# EAGLE schematic Environment2 (EAGLE 7.5.0)
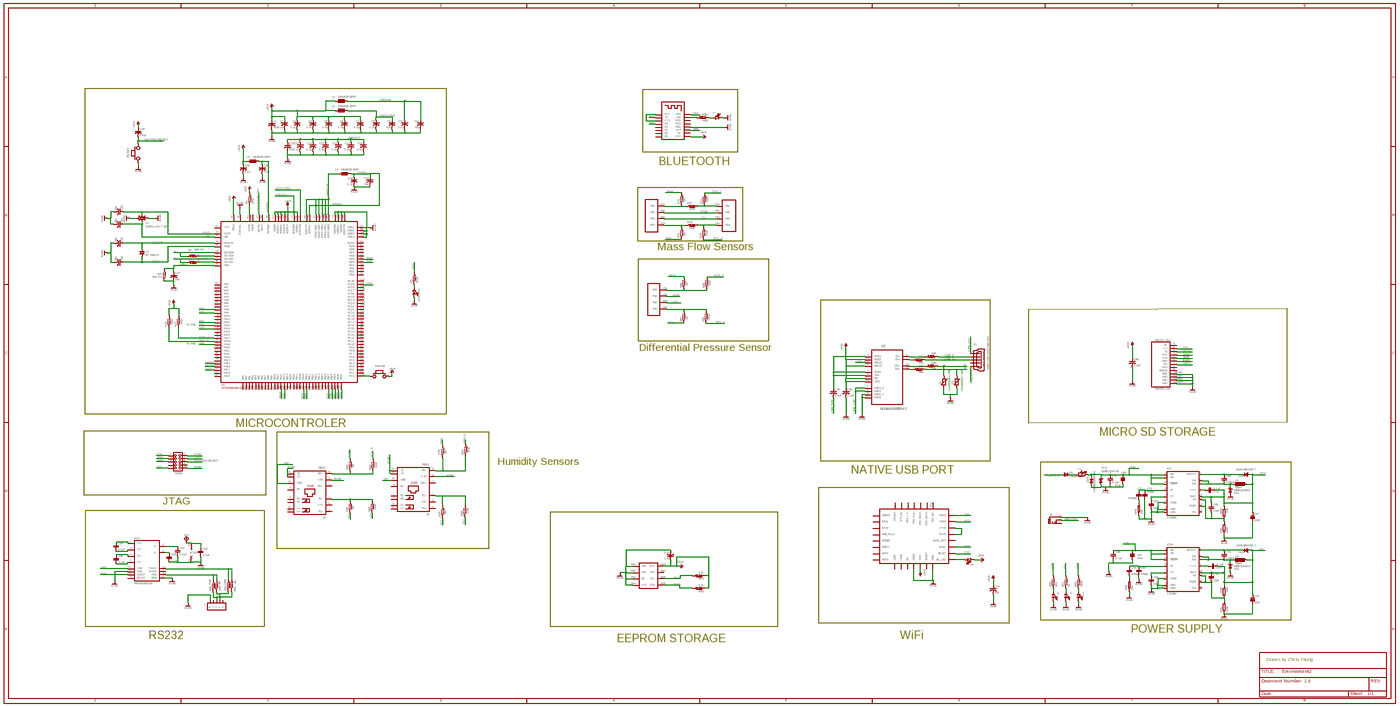
[diagram p0: schematic, sheet 1, overview]
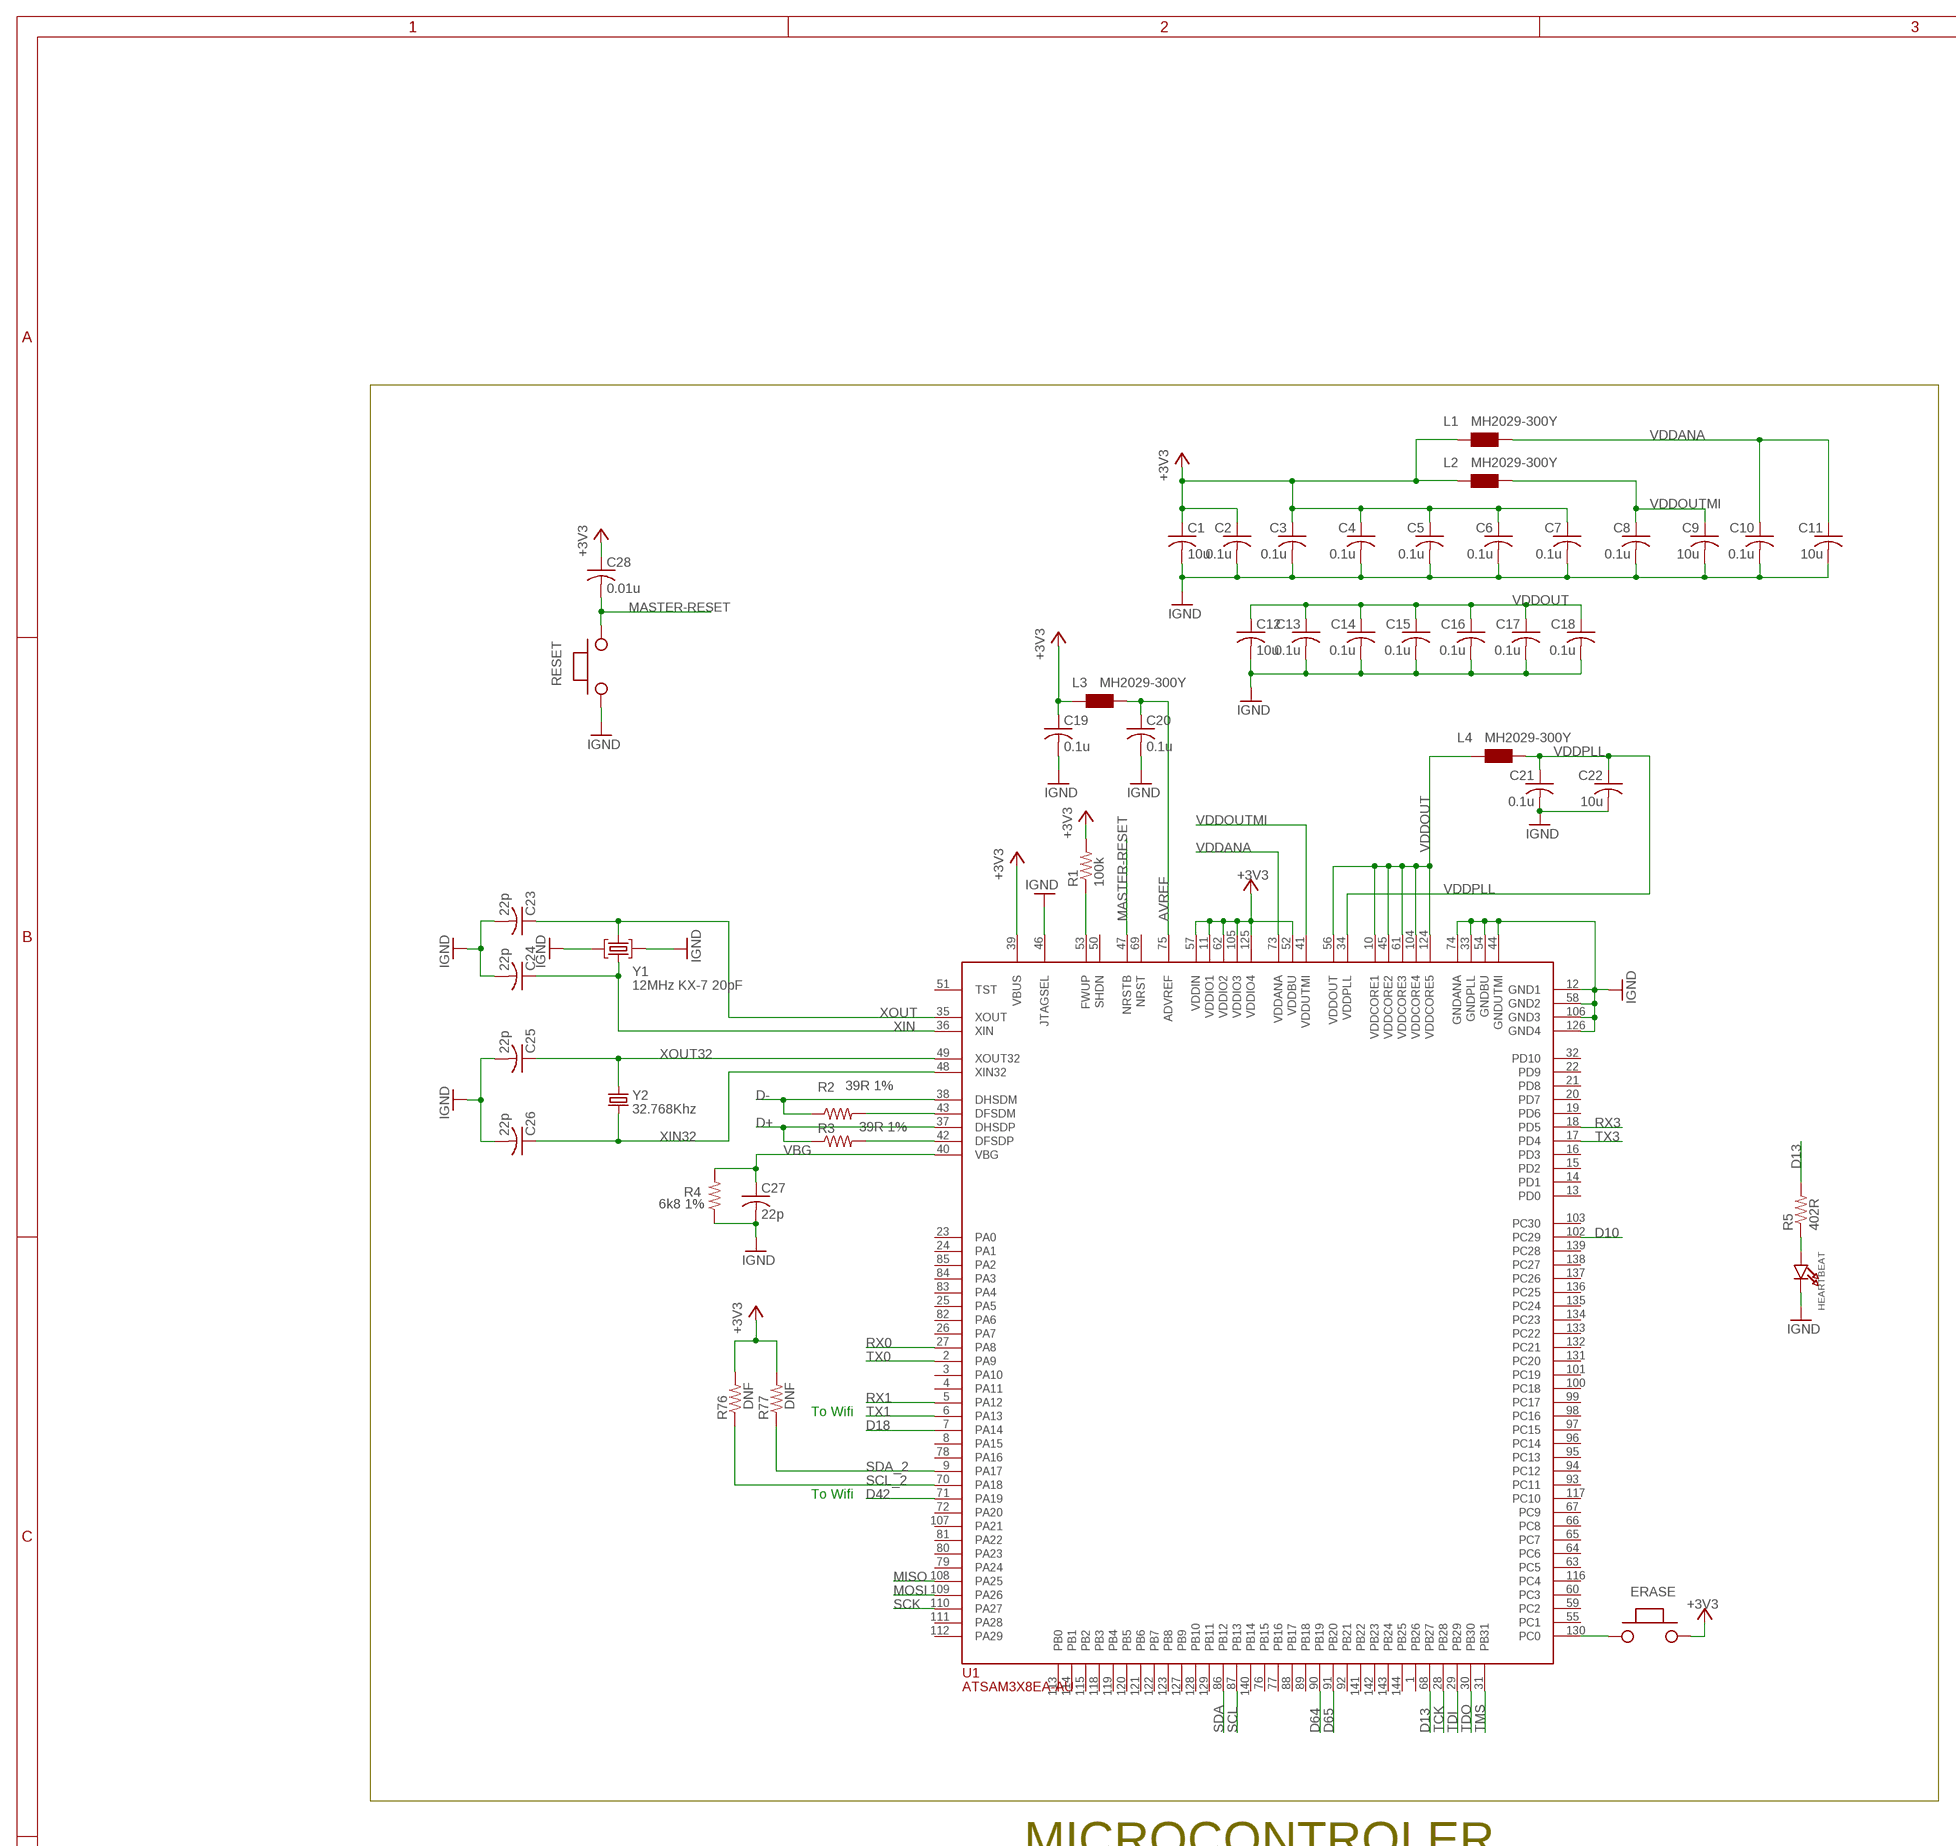
[diagram p1: schematic, sheet 1, part 1 of 7]
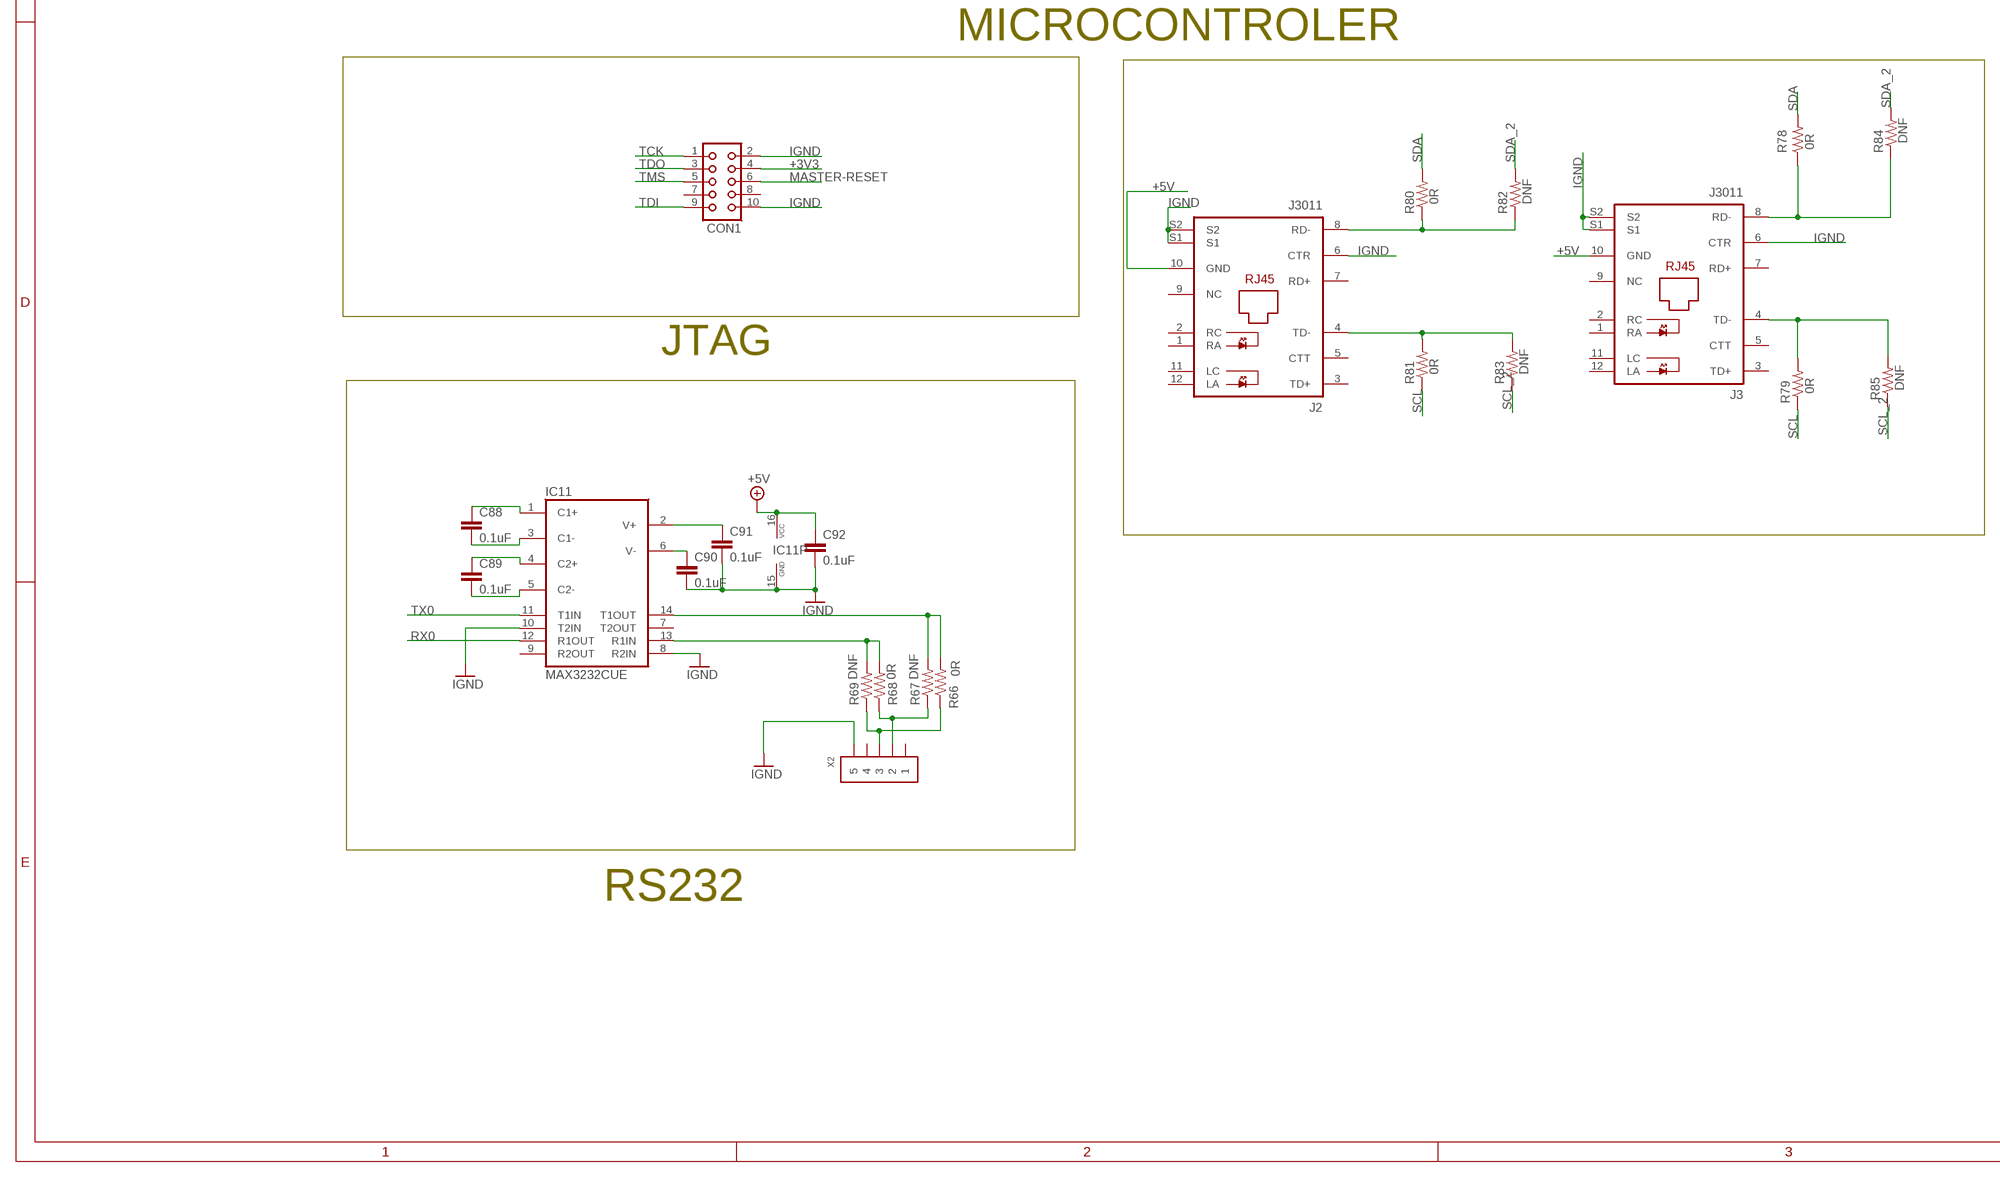
[diagram p2: schematic, sheet 1, part 2 of 7]
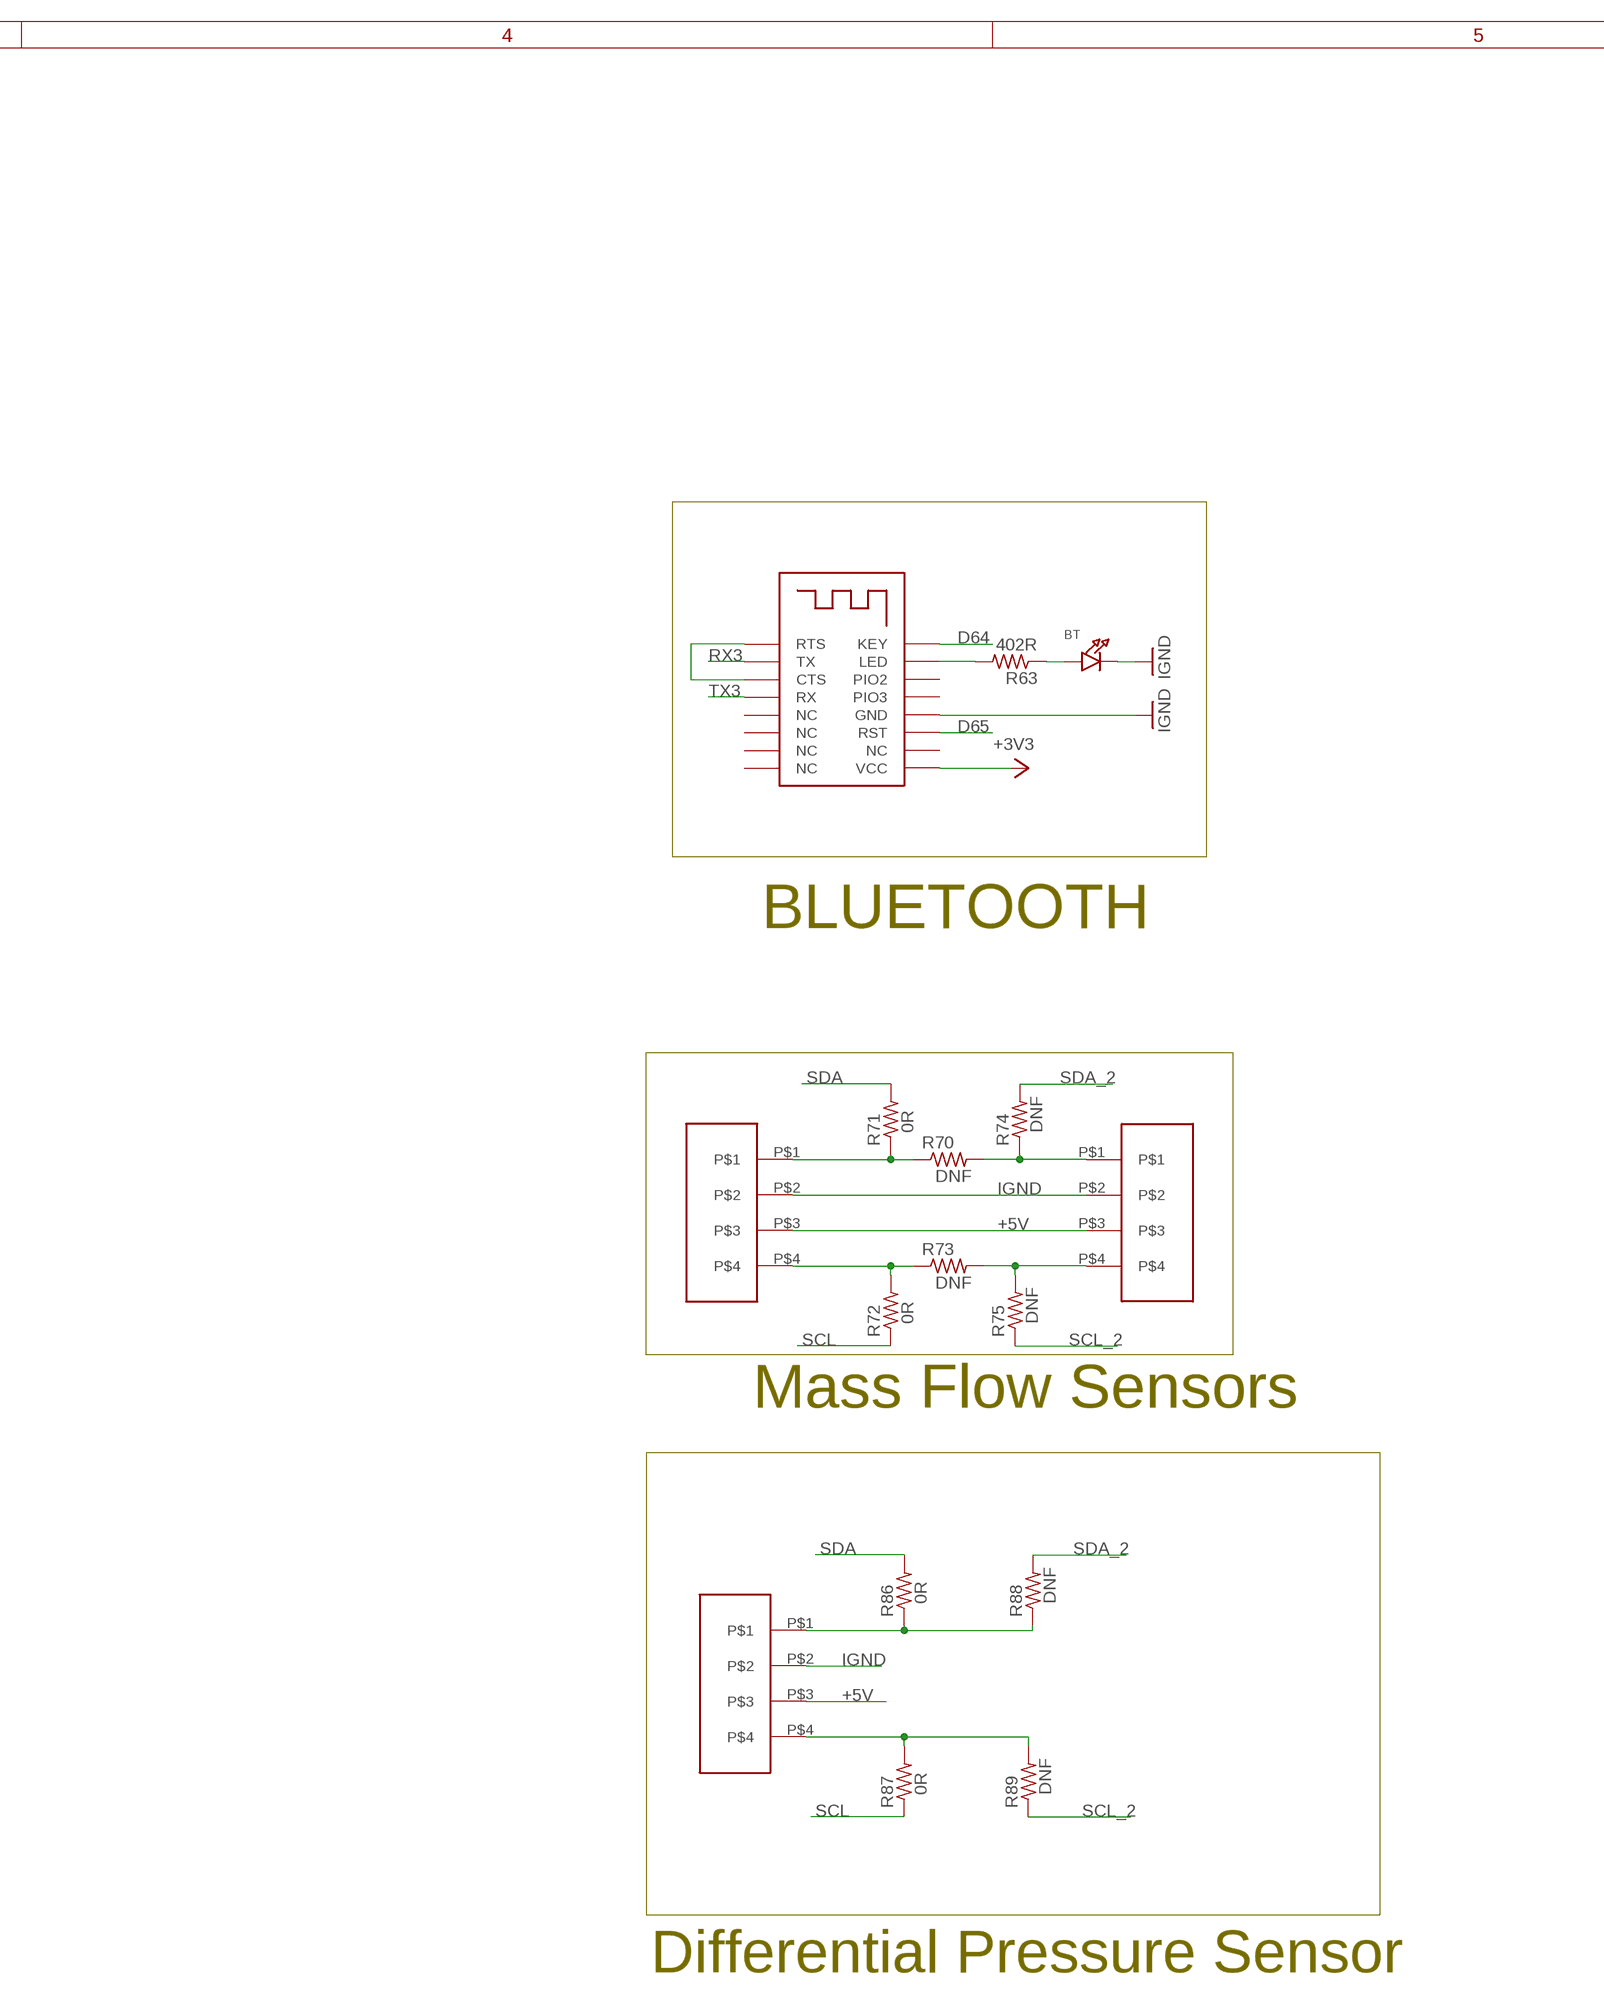
[diagram p3: schematic, sheet 1, part 3 of 7]
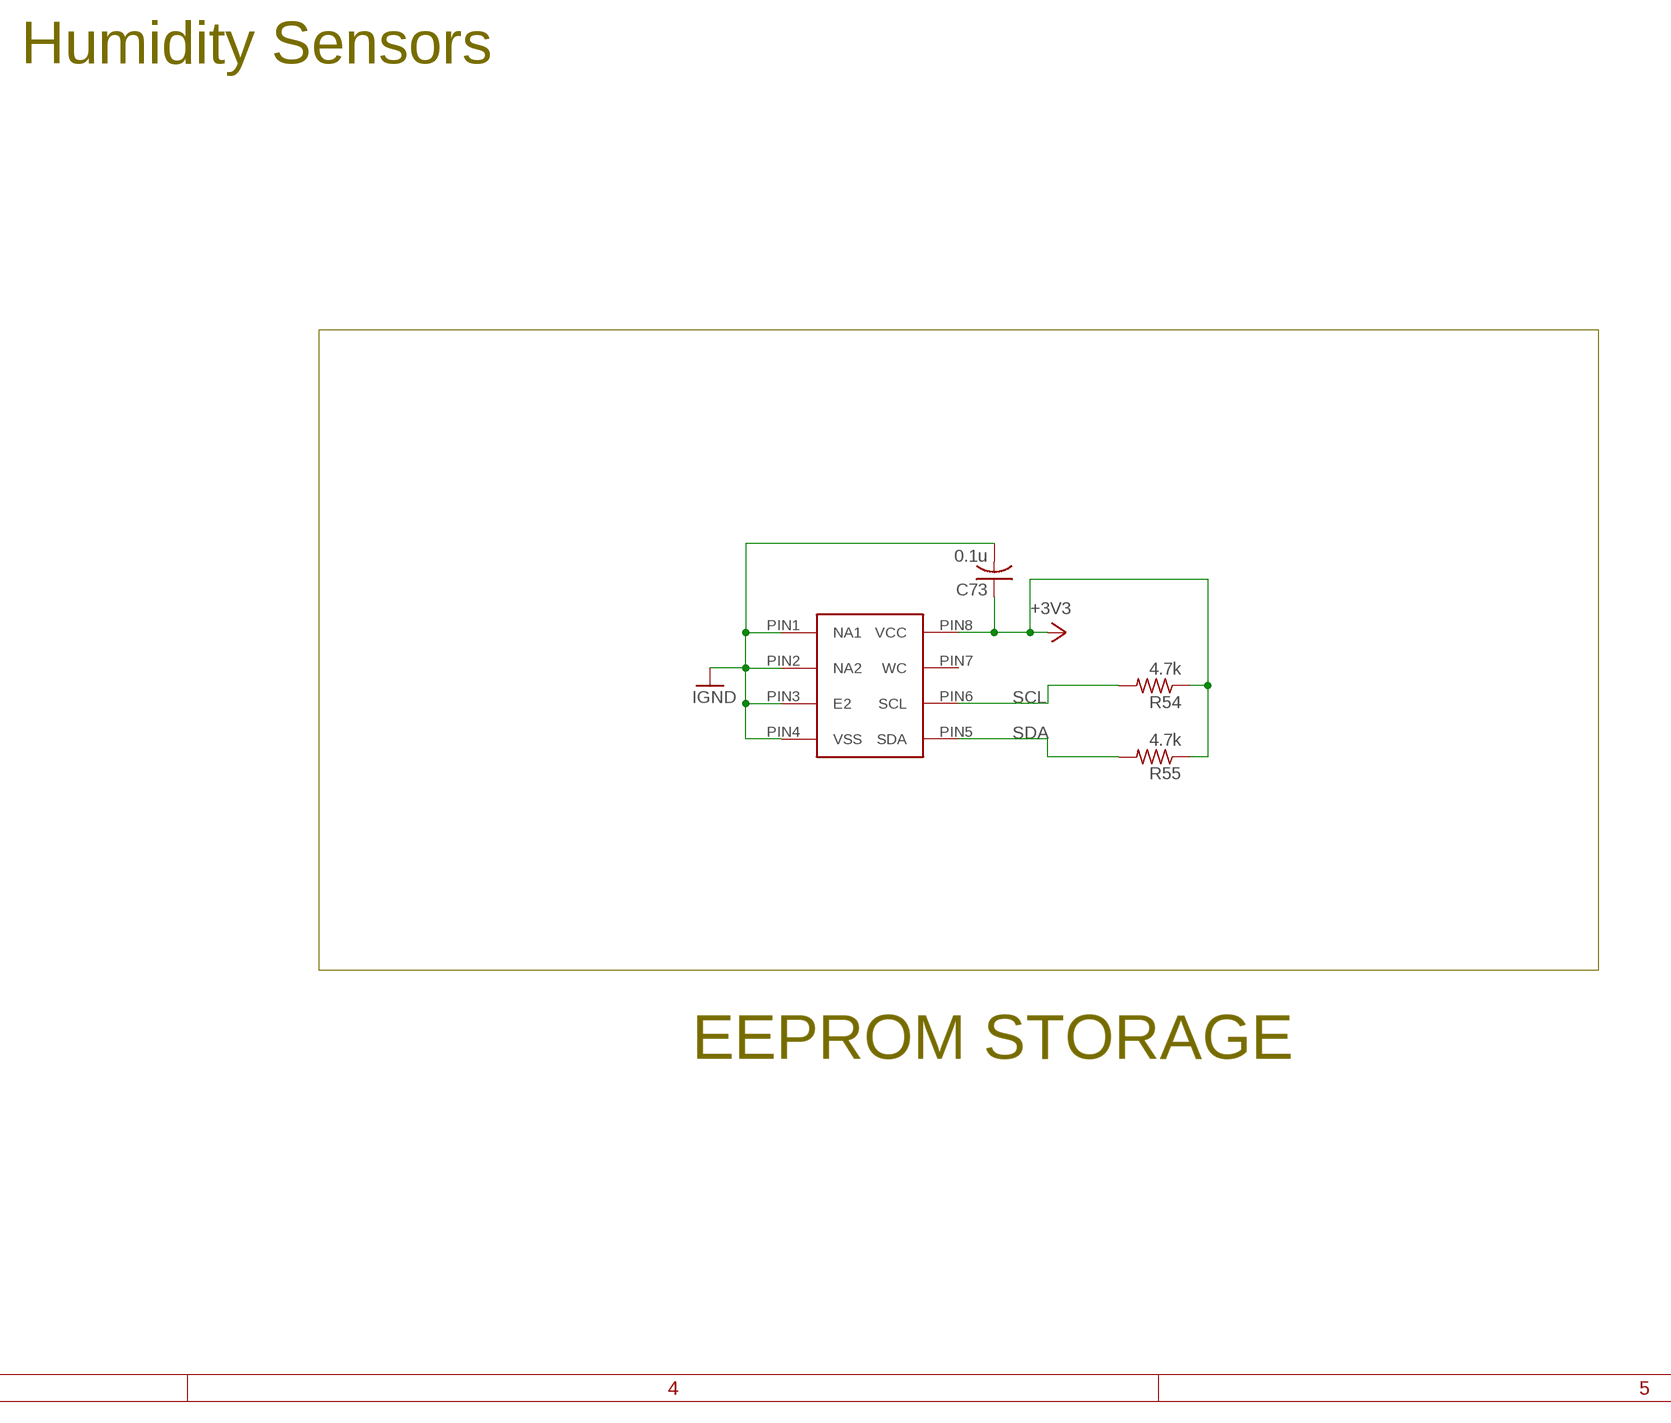
[diagram p4: schematic, sheet 1, part 4 of 7]
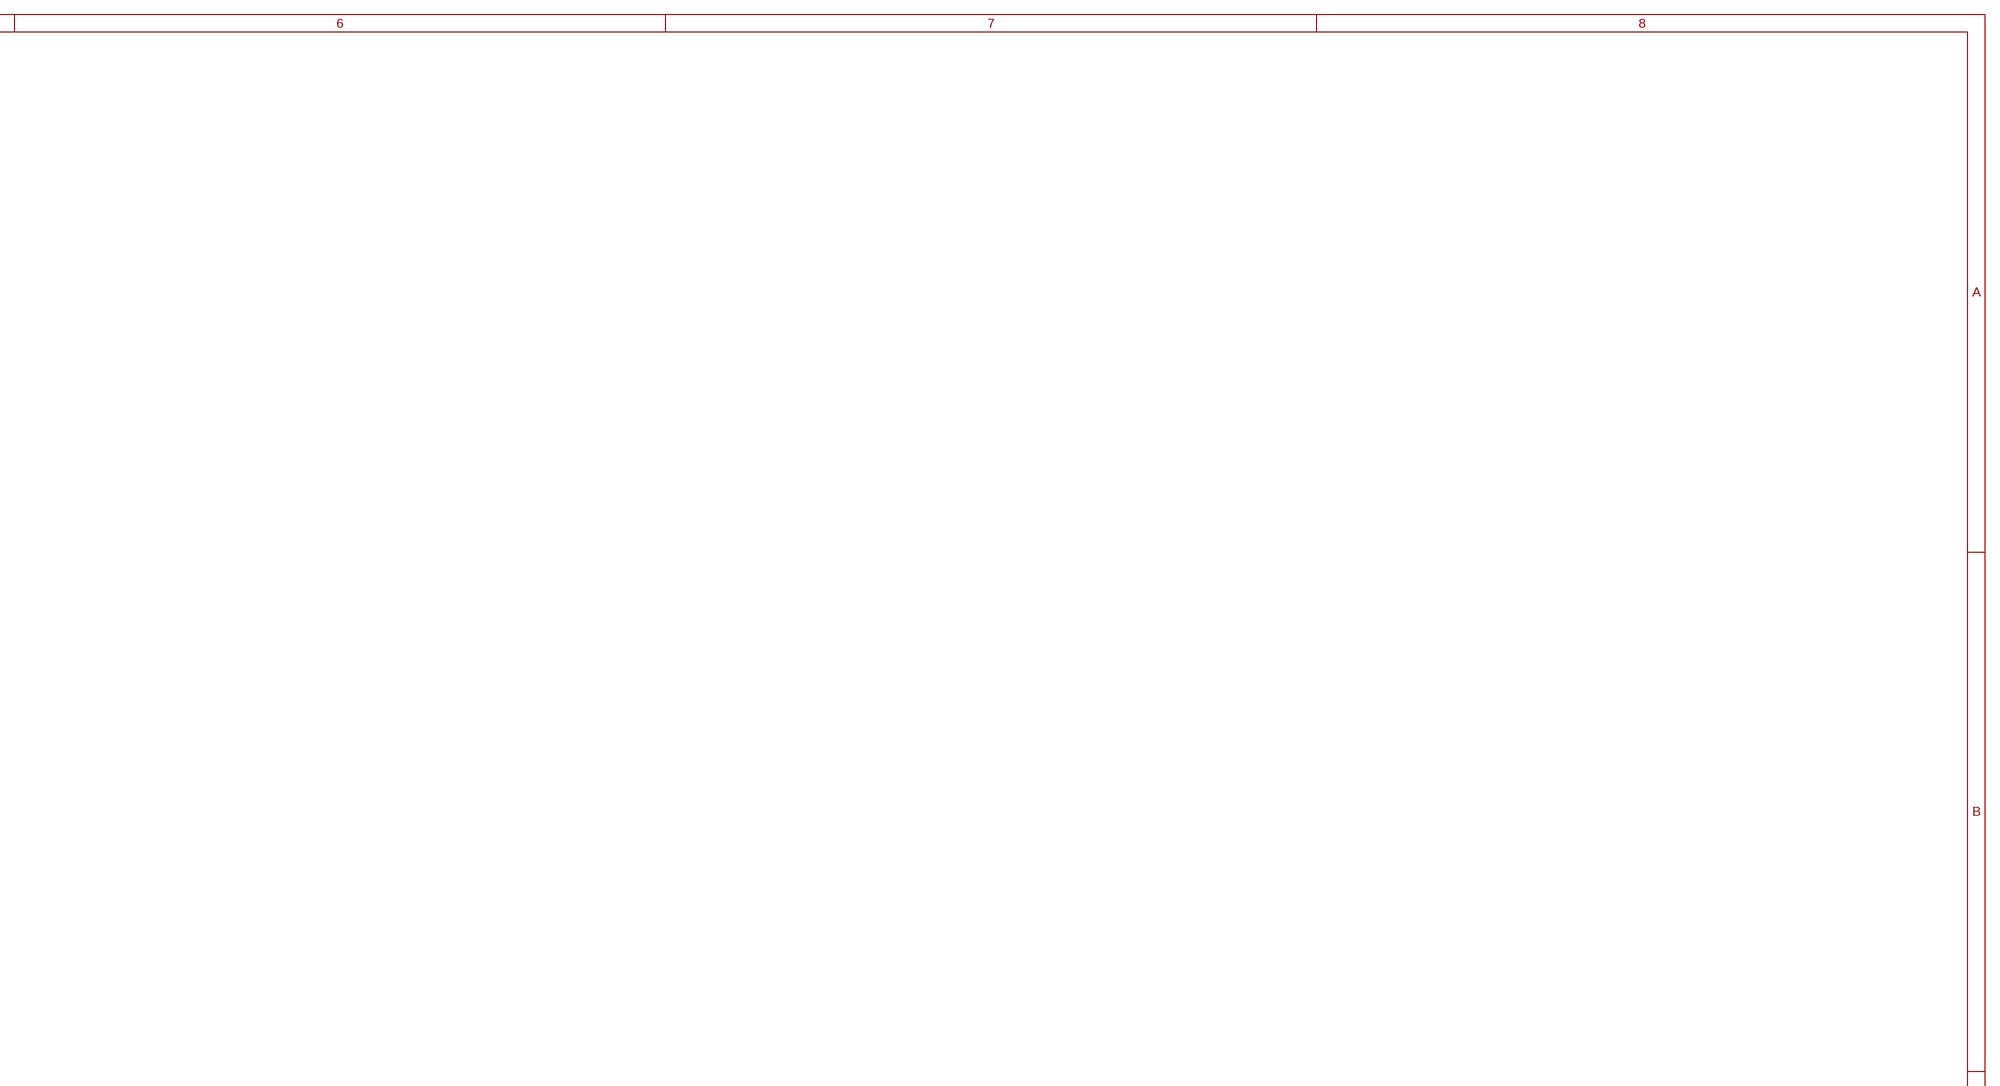
[diagram p5: schematic, sheet 1, part 5 of 7]
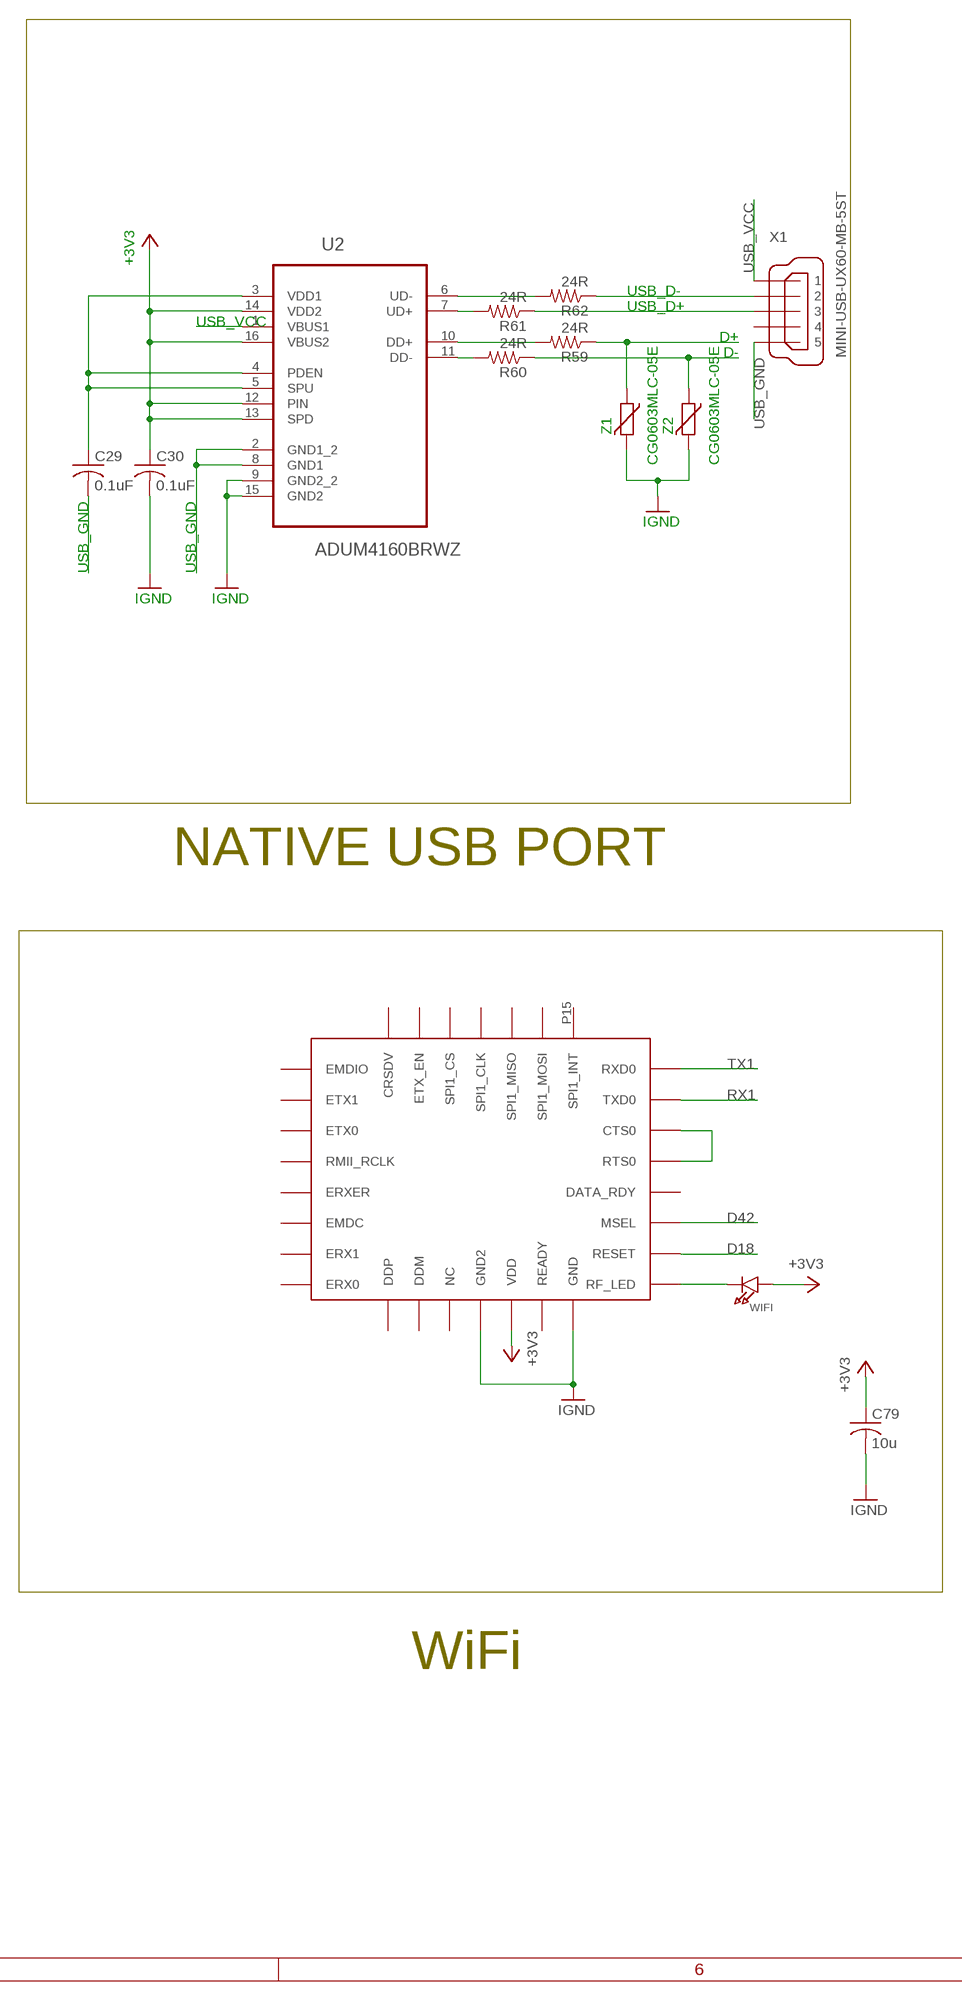
[diagram p6: schematic, sheet 1, part 6 of 7]
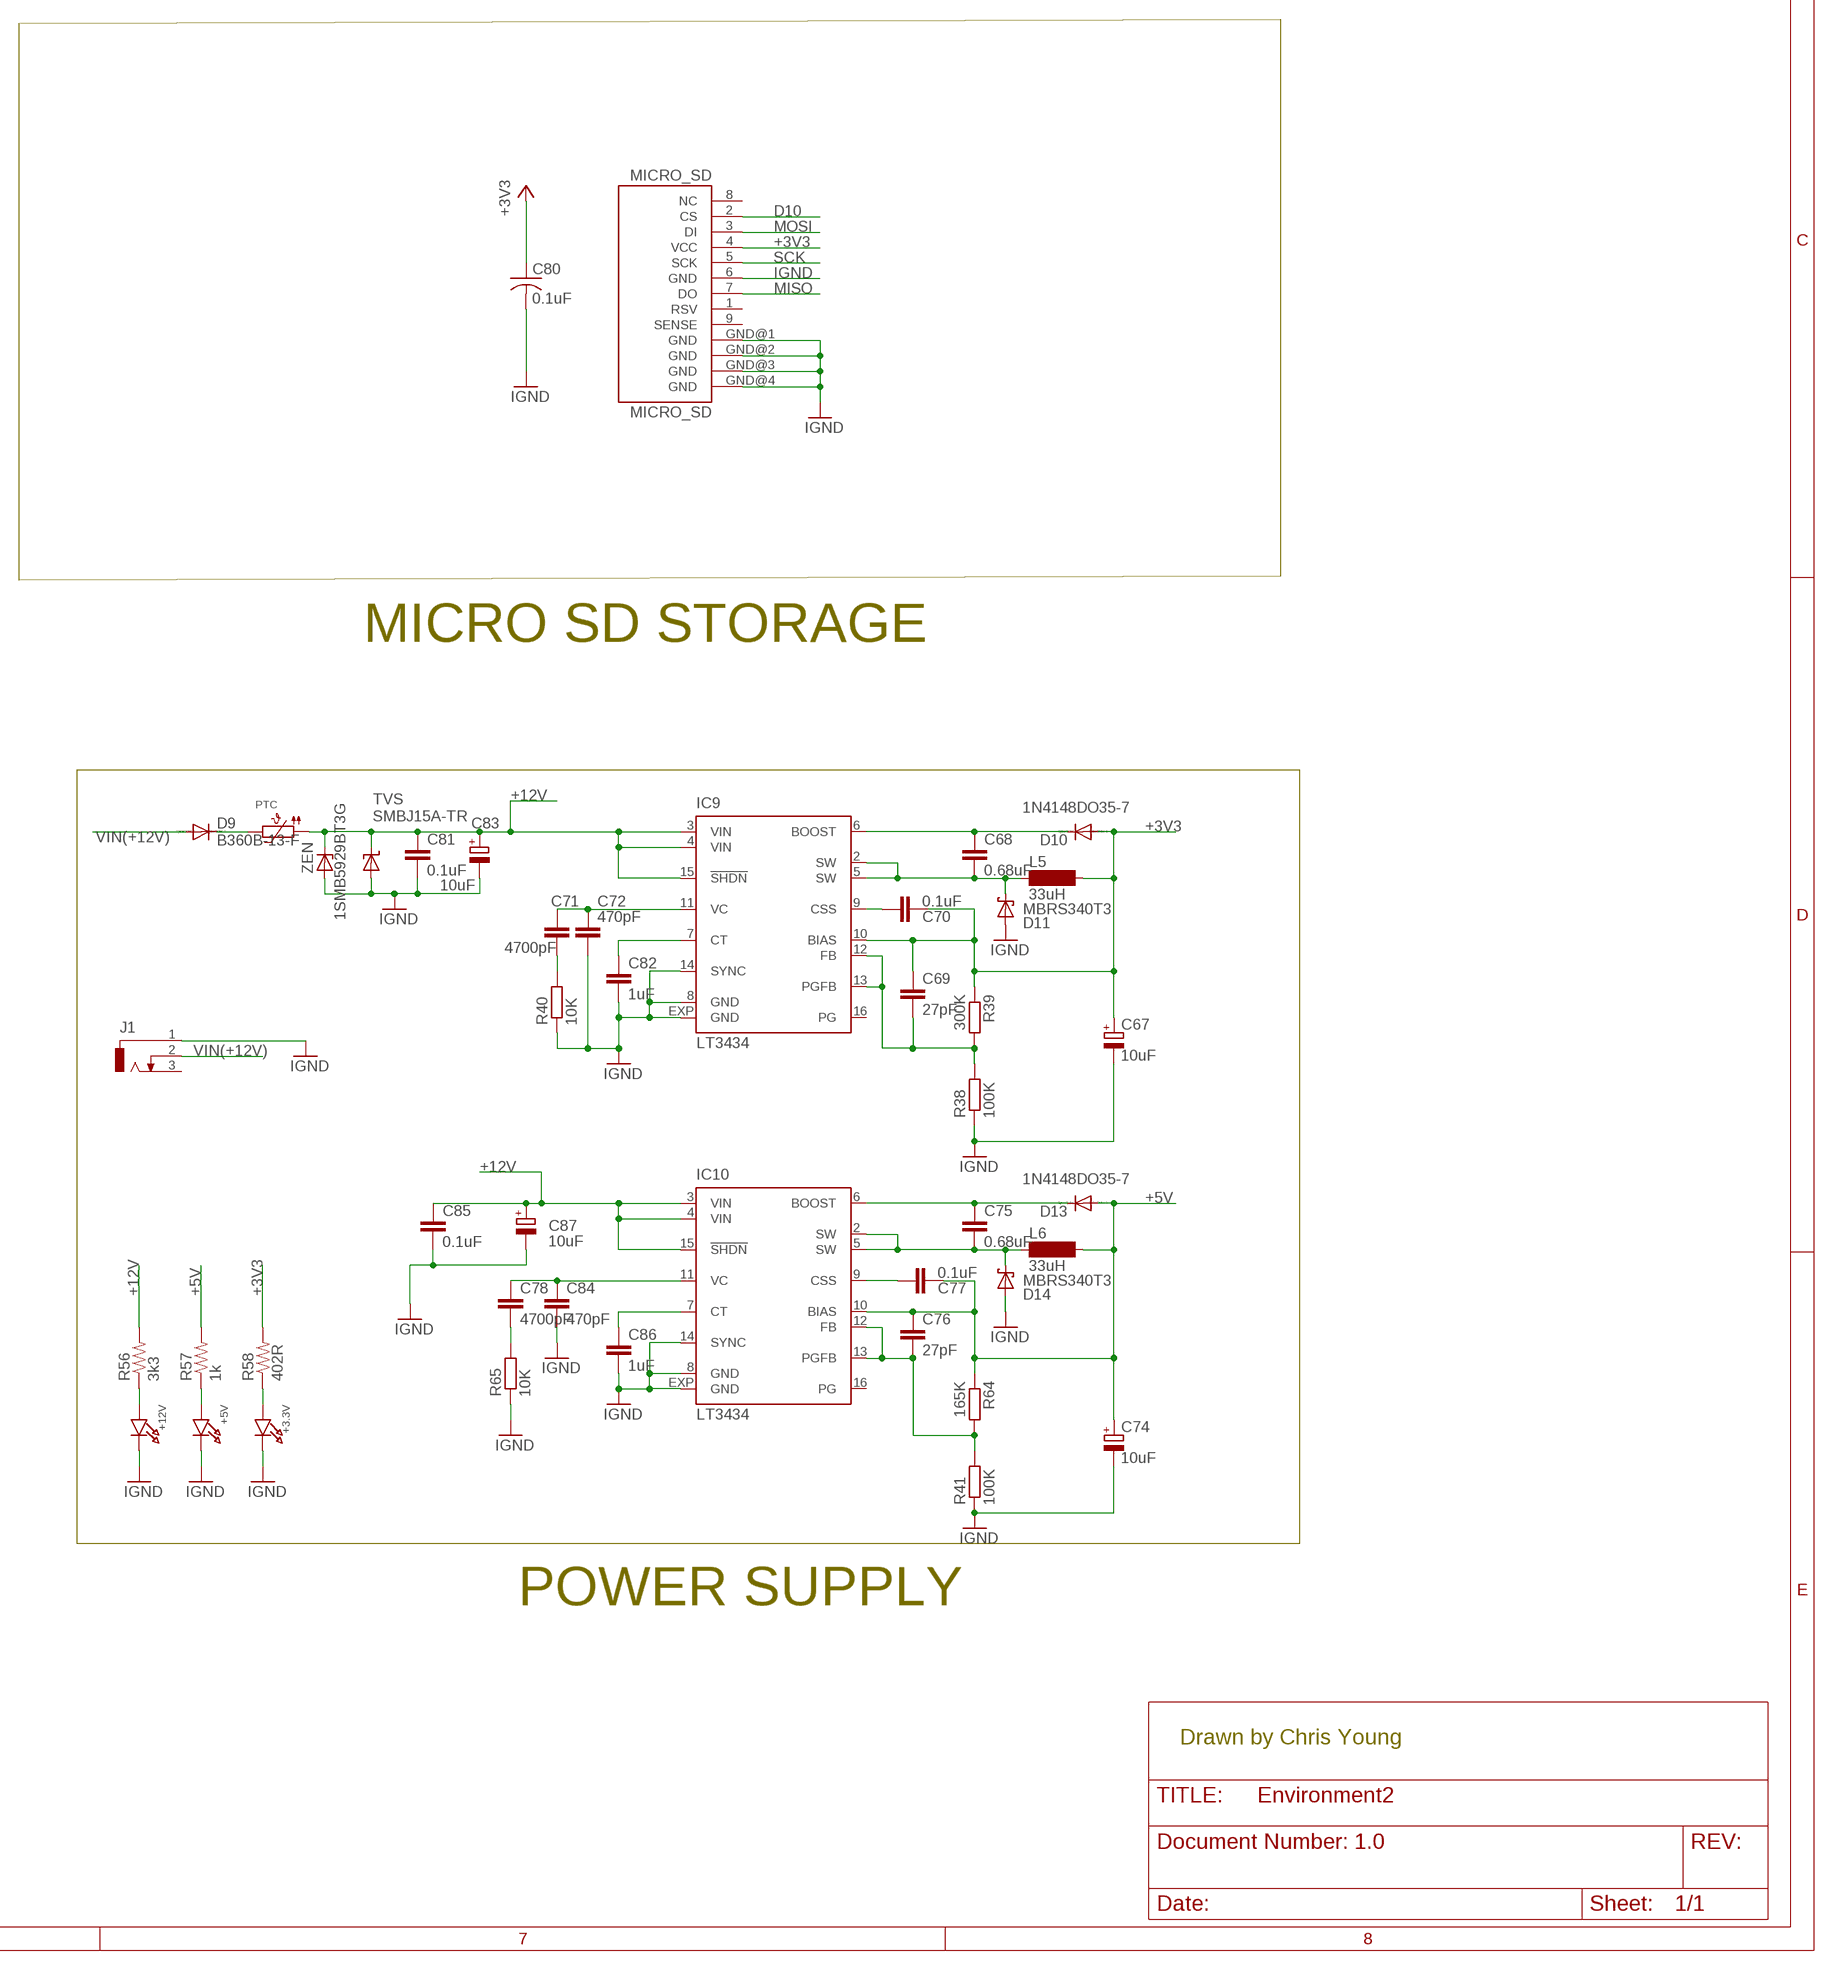
[diagram p7: schematic, sheet 1, part 7 of 7]

## Parts
+3.3V  LED0805  [CHIPLED_0805]
+5V  LED0805  [CHIPLED_0805]
+12V  LED0805  [CHIPLED_0805]
BT  LED0805  [CHIPLED_0805]
C1  10u  C-USC0805  [C0805]
C2  0.1u  C-USC0805  [C0805]
C3  0.1u  C-USC0805  [C0805]
C4  0.1u  C-USC0805  [C0805]
C5  0.1u  C-USC0805  [C0805]
C6  0.1u  C-USC0805  [C0805]
C7  0.1u  C-USC0805  [C0805]
C8  0.1u  C-USC0805  [C0805]
C9  10u  C-USC0805  [C0805]
C10  0.1u  C-USC0805  [C0805]
C11  10u  C-USC0805  [C0805]
C12  10u  C-USC0805  [C0805]
C13  0.1u  C-USC0805  [C0805]
C14  0.1u  C-USC0805  [C0805]
C15  0.1u  C-USC0805  [C0805]
C16  0.1u  C-USC0805  [C0805]
C17  0.1u  C-USC0805  [C0805]
C18  0.1u  C-USC0805  [C0805]
C19  0.1u  C-USC0805  [C0805]
C20  0.1u  C-USC0805  [C0805]
C21  0.1u  C-USC0805  [C0805]
C22  10u  C-USC0805  [C0805]
C23  22p  C-USC1206  [C1206]
C24  22p  C-USC1206  [C1206]
C25  22p  C-USC0805  [C0805]
C26  22p  C-USC0805  [C0805]
C27  22p  C-USC0805  [C0805]
C28  0.01u  C-USC0805  [C0805]
C29  0.1uF  C-USC0805  [C0805]
C30  0.1uF  C-USC0805  [C0805]
C67  10uF  CPOL-EUSMCD  [SMC_D]
C68  0.68uF  C-EUC0603  [C0603]
C69  27pF  C-EUC0603  [C0603]
C70  0.1uF  C-EUC0603  [C0603]
C71  4700pF  C-EUC0603  [C0603]
C72  470pF  C-EUC0603  [C0603]
C73  0.1u  C-USC0805  [C0805]
C74  10uF  CPOL-EUSMCD  [SMC_D]
C75  0.68uF  C-EUC0603  [C0603]
C76  27pF  C-EUC0603  [C0603]
C77  0.1uF  C-EUC0603  [C0603]
C78  4700pF  C-EUC0603  [C0603]
C79  10u  C-USC0805  [C0805]
C80  0.1uF  C-USC0805  [C0805]
C81  0.1uF  C-EUC0603  [C0603]
C82  1uF  C-EUC0603  [C0603]
C83  10uF  CPOL-EUSMCD  [SMC_D]
C84  470pF  C-EUC0603  [C0603]
C85  0.1uF  C-EUC0603  [C0603]
C86  1uF  C-EUC0603  [C0603]
C87  10uF  CPOL-EUSMCD  [SMC_D]
C88  0.1uF  C-EUC0603  [C0603]
C89  0.1uF  C-EUC0603  [C0603]
C90  0.1uF  C-EUC0603  [C0603]
C91  0.1uF  C-EUC0603  [C0603]
C92  0.1uF  C-EUC0603  [C0603]
CON1  CON10  [CON10]
D9  B360B-13-F  DIODE-SMB  [SMB]
D10  1N4148DO35-7  [DO35-7]
D11  MBRS340T3  [SMC]
D13  1N4148DO35-7  [DO35-7]
D14  MBRS340T3  [SMC]
ERASE  PUCHBUTTON  [PUCHBUTTON]
HEARTBEAT  LED0805  [CHIPLED_0805]
IC9  LT3434  [TSSOP16EXP]
IC10  LT3434  [TSSOP16EXP]
IC11  MAX3232CUE  [TSSOP16]
J1  DCJ0303  [DCJ0303]
J2  J3011  [J30]
J3  J3011  [J30]
L1  MH2029-300Y  WE-CBF_0805  [0805]
L2  MH2029-300Y  WE-CBF_0805  [0805]
L3  MH2029-300Y  WE-CBF_0805  [0805]
L4  MH2029-300Y  WE-CBF_0805  [0805]
L5  33uH  MS85  [MS85]
L6  33uH  MS85  [MS85]
MICRO_SD  MICRO_SD  MICROSD_PP  [MICROSD_PP]
PTC  PTC1812  [PTC1812]
R1  100k  R-US_R0805  [R0805]
R2  39R 1%  R-US_R0805  [R0805]
R3  39R 1%  R-US_R0805  [R0805]
R4  6k8 1%  R-US_R0805  [R0805]
R5  402R  R-US_R0805  [R0805]
R38  100K  R-EU_R0603  [R0603]
R39  300K  R-EU_R0603  [R0603]
R40  10K  R-EU_R0603  [R0603]
R41  100K  R-EU_R0603  [R0603]
R54  4.7k  R-US_R0805  [R0805]
R55  4.7k  R-US_R0805  [R0805]
R56  3k3  R-US_R0805  [R0805]
R57  1k  R-US_R0805  [R0805]
R58  402R  R-US_R0805  [R0805]
R59  24R  R-US_R0805  [R0805]
R60  24R  R-US_R0805  [R0805]
R61  24R  R-US_R0805  [R0805]
R62  24R  R-US_R0805  [R0805]
R63  402R  R-US_R0805  [R0805]
R64  165K  R-EU_R0603  [R0603]
R65  10K  R-EU_R0603  [R0603]
R66  0R  R-US_R0805  [R0805]
R67  DNF  R-US_R0805  [R0805]
R68  0R  R-US_R0805  [R0805]
R69  DNF  R-US_R0805  [R0805]
R70  DNF  R-US_R0805  [R0805]
R71  0R  R-US_R0805  [R0805]
R72  0R  R-US_R0805  [R0805]
R73  DNF  R-US_R0805  [R0805]
R74  DNF  R-US_R0805  [R0805]
R75  DNF  R-US_R0805  [R0805]
R76  DNF  R-US_R0805  [R0805]
R77  DNF  R-US_R0805  [R0805]
R78  0R  R-US_R0805  [R0805]
R79  0R  R-US_R0805  [R0805]
R80  0R  R-US_R0805  [R0805]
R81  0R  R-US_R0805  [R0805]
R82  DNF  R-US_R0805  [R0805]
R83  DNF  R-US_R0805  [R0805]
R84  DNF  R-US_R0805  [R0805]
R85  DNF  R-US_R0805  [R0805]
R86  0R  R-US_R0805  [R0805]
R87  0R  R-US_R0805  [R0805]
R88  DNF  R-US_R0805  [R0805]
R89  DNF  R-US_R0805  [R0805]
RESET  PUCHBUTTON  [PUCHBUTTON]
TVS  SMBJ15A-TR  SUPPRESSOR-SMBJ  [SMBJ]
U1  ATSAM3X8EA-AU  ATSAM3X/AAU  [LQFP144]
U2  ADUM4160BRWZ  [SOIC127P1032X265-16N]
U7  CK_CUSTOM_M24M02-DRMN6TP  [CK_CUSTOM_SOIC8]
U8  560020-04  [560020-4]
U9  560020-04  [560020-4]
U10  560020-04  [560020-4]
U$1  NANOREACH  [NANOREACH]
U$3  HM-13  [HM-13]
WIFI  LED0805  [CHIPLED_0805]
X1  MINI-USB-UX60-MB-5ST  [UX60-MB-5ST]
X2  CONN_5-1-502386  [CM-502386-05]
Y1  12MHz KX-7 20pF  CRYSTAL-3.2-2.5  [CRYSTAL-3.2-2.5]
Y2  32.768Khz  ARDUINO_WIFI_SHIELD_V018_TG_RESONATOR_EPSON_FC_145  [ARDUINO_WIFI_SHIELD_V018_TG_RESONATOR_EPSON_FC_145]
Z1  CG0603MLC-05E  VARISTORCN0603  [CT/CN0603]
Z2  CG0603MLC-05E  VARISTORCN0603  [CT/CN0603]
ZEN  1SMB5929BT3G  ZENER-DIODESMB  [SMB]

## Nets
+3V3: C1.1 C2.1 C3.1 C4.1 C5.1 C6.1 C7.1 C19.1 C28.1 C30.1 C67.+ C69.1 C70.2 C73.1 C79.1 C80.1 CON1.4 D10.A ERASE.P$2 IC9.10(BIAS) L1.1 L2.1 L3.1 L5.2 MICRO_SD.4(VCC) R1.2 R39.1 R54.1 R55.1 R58.2 R76.2 R77.2 U1.11(VDDIO1) U1.39(VBUS) U1.52(VDDBU) U1.57(VDDIN) U1.62(VDDIO2) U1.105(VDDIO3) U1.125(VDDIO4) U2.12(PIN) U2.13(SPD) U2.14(VDD2) U2.16(VBUS2) U7.PIN8(VCC) U$1.P1(VDD) U$3.P$9(VCC) WIFI.A
+5V: C74.+ C76.1 C77.2 C92.1 D13.A IC10.10(BIAS) IC11.16(VCC) J2.10(GND) L6.2 R57.2 R64.1 U8.P$3 U9.P$3 U10.P$3
+12V: C81.1 C83.+ C85.1 C87.+ IC9.3(VIN) IC9.4(VIN) IC9.15(!SHDN) IC10.3(VIN) IC10.4(VIN) IC10.15(!SHDN) PTC.P$1 R56.2 TVS.C ZEN.C
A: R70.2 R74.1 U9.P$1
AVREF: C20.1 L3.2 U1.75(ADVREF)
B: R73.2 R75.2 U9.P$4
D10: MICRO_SD.2(CS) U1.102(PC29)
D13: R5.2 U1.68(PB27)
D18: U1.7(PA14) U$1.P9(RESET)
D42: U1.71(PA19) U$1.P8(MSEL)
D64: U1.90(PB19) U$3.P$16(KEY)
D65: U1.91(PB20) U$3.P$11(RST)
D+ [USB]: R3.1 R59.1 U1.37(DHSDP) Z1.1
D- [USB]: R2.1 R60.1 U1.38(DHSDM) Z2.1
ERASE_S: ERASE.P$1 U1.130(PC0)
IGND: +3.3V.C +5V.C +12V.C BT.C C1.2 C2.2 C3.2 C4.2 C5.2 C6.2 C7.2 C8.2 C9.2 C10.2 C11.2 C12.2 C13.2 C14.2 C15.2 C16.2 C17.2 C18.2 C19.2 C20.2 C21.2 C22.2 C23.2 C24.2 C25.2 C26.2 C27.2 C30.2 C67.- C72.2 C73.2 C74.- C79.2 C80.2 C81.2 C82.2 C83.- C84.2 C85.2 C86.2 C87.- C90.2 C91.2 C92.2 CON1.2 CON1.10 D11.A D14.A HEARTBEAT.C IC9.8(GND) IC9.14(SYNC) IC9.EXP(GND) IC10.8(GND) IC10.14(SYNC) IC10.EXP(GND) IC11.8(R2IN) IC11.10(T2IN) IC11.15(GND) J1.1 J2.6(CTR) J2.S1 J2.S2 J3.6(CTR) J3.S1 J3.S2 MICRO_SD.6(GND) MICRO_SD.GND@1(GND) MICRO_SD.GND@2(GND) MICRO_SD.GND@3(GND) MICRO_SD.GND@4(GND) R4.1 R38.1 R40.1 R41.1 R65.1 RESET.P$1 TVS.A U1.12(GND1) U1.33(GNDPLL) U1.44(GNDUTMI) U1.46(JTAGSEL) U1.54(GNDBU) U1.58(GND2) U1.74(GNDANA) U1.106(GND3) U1.126(GND4) U2.9(GND2_2) U2.15(GND2) U7.PIN1(NA1) U7.PIN2(NA2) U7.PIN3(E2) U7.PIN4(VSS) U8.P$2 U9.P$2 U10.P$2 U$1.P2(GND) U$1.P20(GND2) U$3.P$12(GND) X2.5 Y1.2(GND) Y1.4(GND) Z1.2 Z2.2 ZEN.A
MASTER-RESET: C28.2 CON1.6 RESET.P$2 U1.47(NRSTB)
MISO: MICRO_SD.7(DO) U1.108(PA25)
MOSI: MICRO_SD.3(DI) U1.109(PA26)
N$2: +3.3V.A R58.1
N$3: D9.C PTC.P$2
N$4: +5V.A R57.1
N$5: C29.1 U2.3(VDD1) U2.4(PDEN) U2.5(SPU)
N$6: HEARTBEAT.A R5.1
N$7: U$3.P$1(RTS) U$3.P$3(CTS)
N$10: R62.2 U2.6(UD-)
N$11: R61.2 U2.7(UD+)
N$24: C71.1 C72.1 IC9.11(VC)
N$26: C70.1 IC9.9(CSS)
N$27: C68.1 D10.C IC9.6(BOOST)
N$28: C71.2 R40.2
N$29: C68.2 D11.C IC9.2(SW) IC9.5(SW) L5.1
N$30: C82.1 IC9.7(CT)
N$42: R59.2 U2.10(DD+)
N$44: +12V.A R56.1
N$45: R60.2 U2.11(DD-)
N$46: BT.A R63.1
N$47: R63.2 U$3.P$15(LED)
N$52: U$1.P5(CTS0) U$1.P6(RTS0)
N$53: R2.2 U1.43(DFSDM)
N$56: R3.2 U1.42(DFSDP)
N$59: R1.1 U1.53(FWUP)
N$62: C69.2 IC9.12(FB) IC9.13(PGFB) R38.2 R39.2
N$63: C75.1 D13.C IC10.6(BOOST)
N$64: C77.1 IC10.9(CSS)
N$69: C75.2 D14.C IC10.2(SW) IC10.5(SW) L6.1
N$70: C86.1 IC10.7(CT)
N$72: C78.1 C84.1 IC10.11(VC)
N$74: C78.2 R65.2
N$80: C88.1 IC11.1(C1+)
N$81: C88.2 IC11.3(C1-)
N$82: C89.1 IC11.4(C2+)
N$83: R66.1 R69.1 X2.3
N$84: R67.1 R68.1 X2.2
N$85: R70.1 R71.1 U10.P$1
N$87: R72.2 R73.1 U10.P$4
N$89: J2.8(RD-) R80.1 R82.1
N$91: J2.4(TD-) R81.2 R83.2
N$92: J3.8(RD-) R78.1 R84.1
N$98: J3.4(TD-) R79.2 R85.2
N$100: R86.1 R88.1 U8.P$1
N$101: R87.2 R89.2 U8.P$4
N$103: C76.2 IC10.12(FB) IC10.13(PGFB) R41.2 R64.2
N$115: C89.2 IC11.5(C2-)
N$128: C90.1 IC11.6(V-)
N$137: IC11.14(T1OUT) R66.2 R67.2
N$139: IC11.13(R1IN) R68.2 R69.2
N$147: C91.1 IC11.2(V+)
RX0: IC11.12(R1OUT) U1.27(PA8)
RX1: U1.5(PA12) U$1.P4(TXD0)
RX3: U1.18(PD5) U$3.P$2(TX)
SCK: MICRO_SD.5(SCK) U1.110(PA27)
SCL: R54.2 R72.1 R79.1 R81.1 R87.1 U1.87(PB13) U7.PIN6(SCL)
SCL_2: R75.1 R76.1 R83.1 R85.1 R89.1 U1.70(PA18)
SDA: R55.2 R71.2 R78.2 R80.2 R86.2 U1.86(PB12) U7.PIN5(SDA)
SDA_2: R74.2 R77.1 R82.2 R84.2 R88.2 U1.9(PA17)
TCK: CON1.1 U1.28(PB28)
TDI: CON1.9 U1.29(PB29)
TDO: CON1.3 U1.30(PB30)
TMS: CON1.5 U1.31(PB31)
TX0: IC11.11(T1IN) U1.2(PA9)
TX1: U1.6(PA13) U$1.P3(RXD0)
TX3: U1.17(PD4) U$3.P$4(RX)
USB_D+: R61.1 X1.3
USB_D-: R62.1 X1.2
USB_GND: C29.2 U2.2(GND1_2) U2.8(GND1) X1.5
USB_VCC: U2.1(VBUS1) X1.1
VBG: C27.1 R4.2 U1.40(VBG)
VDDANA: C10.1 C11.1 L1.2 U1.73(VDDANA)
VDDOUT: C12.1 C13.1 C14.1 C15.1 C16.1 C17.1 C18.1 L4.1 U1.10(VDDCORE1) U1.45(VDDCORE2) U1.56(VDDOUT) U1.61(VDDCORE3) U1.104(VDDCORE4) U1.124(VDDCORE5)
VDDOUTMI: C8.1 C9.1 L2.2 U1.41(VDDUTMI)
VDDPLL: C21.1 C22.1 L4.2 U1.34(VDDPLL)
VIN(+12V): D9.A J1.2
WIFI: U$1.P10(RF_LED) WIFI.C
XIN: C24.1 U1.36(XIN) Y1.1(C1)
XIN32: C26.1 U1.48(XIN32) Y2.P$2
XOUT: C23.1 U1.35(XOUT) Y1.3(C2)
XOUT32: C25.1 U1.49(XOUT32) Y2.P$1
Unconnected: CON1.7 CON1.8 IC9.16(PG) IC10.16(PG) IC11.7(T2OUT) IC11.9(R2OUT) J1.3 J2.1(RA) J2.2(RC) J2.3(TD+) J2.5(CTT) J2.7(RD+) J2.9(NC) J2.11(LC) J2.12(LA) J3.1(RA) J3.2(RC) J3.3(TD+) J3.5(CTT) J3.7(RD+) J3.9(NC) J3.10(GND) J3.11(LC) J3.12(LA) MICRO_SD.1(RSV) MICRO_SD.8(NC) MICRO_SD.9(SENSE) U1.1(PB26) U1.3(PA10) U1.4(PA11) U1.8(PA15) U1.13(PD0) U1.14(PD1) U1.15(PD2) U1.16(PD3) U1.19(PD6) U1.20(PD7) U1.21(PD8) U1.22(PD9) U1.23(PA0) U1.24(PA1) U1.25(PA5) U1.26(PA7) U1.32(PD10) U1.50(SHDN) U1.51(TST) U1.55(PC1) U1.59(PC2) U1.60(PC3) U1.63(PC5) U1.64(PC6) U1.65(PC7) U1.66(PC8) U1.67(PC9) U1.69(NRST) U1.72(PA20) U1.76(PB15) U1.77(PB16) U1.78(PA16) U1.79(PA24) U1.80(PA23) U1.81(PA22) U1.82(PA6) U1.83(PA4) U1.84(PA3) U1.85(PA2) U1.88(PB17) U1.89(PB18) U1.92(PB21) U1.93(PC11) U1.94(PC12) U1.95(PC13) U1.96(PC14) U1.97(PC15) U1.98(PC16) U1.99(PC17) U1.100(PC18) U1.101(PC19) U1.103(PC30) U1.107(PA21) U1.111(PA28) U1.112(PA29) U1.113(PB0) U1.114(PB1) U1.115(PB2) U1.116(PC4) U1.117(PC10) U1.118(PB3) U1.119(PB4) U1.120(PB5) U1.121(PB6) U1.122(PB7) U1.123(PB8) U1.127(PB9) U1.128(PB10) U1.129(PB11) U1.131(PC20) U1.132(PC21) U1.133(PC22) U1.134(PC23) U1.135(PC24) U1.136(PC25) U1.137(PC26) U1.138(PC27) U1.139(PC28) U1.140(PB14) U1.141(PB22) U1.142(PB23) U1.143(PB24) U1.144(PB25) U7.PIN7(WC) U$1.P7(DATA_RDY) U$1.P11(SPI1_CS) U$1.P12(SPI1_CLK) U$1.P13(SPI1_MISO) U$1.P14(SPI1_MOSI) U$1.P15(SPI1_INT) U$1.P16(READY) U$1.P17(DDP) U$1.P18(DDM) U$1.P19(NC) U$1.P21(ETX_EN) U$1.P22(RMII_RCLK) U$1.P23(CRSDV) U$1.P24(ERXER) U$1.P25(EMDIO) U$1.P26(EMDC) U$1.P27(ETX1) U$1.P28(ERX1) U$1.P29(ETX0) U$1.P30(ERX0) U$3.P$5(NC) U$3.P$6(NC) U$3.P$7(NC) U$3.P$8(NC) U$3.P$10(NC) U$3.P$13(PIO3) U$3.P$14(PIO2) X1.4 X2.1 X2.4

## Notes on the sheet
- BLUETOOTH
- Mass Flow Sensors
- To Wifi
- To Wifi
- Differential Pressure Sensor
- MICROCONTROLER
- MICRO SD STORAGE
- Humidity Sensors
- NATIVE USB PORT
- JTAG
- POWER SUPPLY
- RS232 | EEPROM STORAGE | WiFi
- Drawn by Chris Young

## Library data of the parts
+3.3V +5V +12V BT HEARTBEAT WIFI = microbuilder:LED: LED 0603 - 0603 Surface Mount Package 2mA: Green LED - Low Power (3.9mcd, 2ma, 1.7Vf) - Digikey: 475-2709-2-ND Orange LED - Low Power (9.8mcd, 2ma, 1.8Vf) - Digikey: 475-1194-2-ND Red LED - Low Power (5mcd, 2ma, 1.8Vf) - Digikey: 475-1195-2-ND Yellow LED - Low Power (7mcd, 2ma, 1.8Vf) - Digikey: 475-1196-2-ND 5mA: Blue LED - Low Power (17mcd, 5ma, 2.9Vf) - Digikey: LNJ937W8CRACT-ND 0805 - 0805 Surface Mount Package 2mA: Red LED (8.8mcd, 2mA, 1.8Vf, Clear) - Low Power [Digikey: 475-2510-1-ND] Green LED (5mcd, 2mA, 1.8Vf, Clear) - Low Power [Digikey: 475-2730-1-ND] Yellow LED (11.3mcd, 2mA, 1.8Vf, Clear) - Low Power [Digikey: 475-2555-1-ND] 20mA: Red LED (104mcd, 20mA, Diffused) - LS R976 [Digikey: 475-1278-6-ND] Red LED (12mcd, 20mA, 2.0Vf, Clear) - APT2012EC [Digikey: 754-1128-1-ND] Green LED (15mcd, 20mA, 2.2Vf, Clear) - APT2012GC [Digikey: 754-1131-1-ND] Orange LED (160mcd, 20mA, 2.1Vf, Clear) - APT2012SECK [Digikey: 754-1130-1-ND] 1206 - 1206 Surface Mount Package Green LED (26mcd, 20mA, Diffused) - LG N971 [Digikey: 475-1407-6-ND] Red LED (15mcd, 20mA, Diffused) - LH N974 [Digikey: 475-1416-6-ND]
C1-C30 C73 C79 C80 = rcl:C-US: CAPACITOR, American symbol
C67 C74 C83 C87 = rcl:CPOL-EU: POLARIZED CAPACITOR, European symbol
C68-C72 C75-C78 C81 C82 C84-C86 C88-C92 = rcl:C-EU: CAPACITOR, European symbol
CON1 = con-harting:CON10: CONNECTOR; OC_FARNELL: unknown; OC_NEWARK: unknown
D9 = diode:DIODE-: DIODE
D10 D13 = diode:1N4148: DIODE high speed (Philips)
D11 D14 = diode:MBRS3*0T3: SCHOTTKY BARRIER RECTIFIER 3.0 AMPERES 20, 30, 40 VOLT Source: MBRS340T3-D.pdf
ERASE = PushButton:PUCHBUTTON; BUTTON: ERASE; ERASE: Erase
IC9 IC10 = linear-technology:LT3434: High Voltage 3A, 200kHz Step-Down Switching Regulator with 100µA Quiescent Current Spurce: www.linear.com .. 3434fb.pdf; MPN: LT3434EFE#PBF; OC_FARNELL: 1501035; OC_NEWARK: 57M8118
IC11 = maxim:MAX3232*: True RS-232 Transceivers 3.0V to 5.5V, Low-Power up to 1Mbps, Using Four 0.1µF External Capacitors Source: http://pdfserv.maxim-ic.com/en/ds/MAX3222-MAX3241.pdf; MF: MAXIM; MPN: MAX3232CUE+; OC_FARNELL: 1593350; OC_NEWARK: 68K4629
J1 = con-jack:DCJ0303: DC POWER JACK Source: DCJ0303.pdf; OC_FARNELL: unknown; OC_NEWARK: unknown
J2 J3 = pulse-eng:J3011: RJ45 PulseJack w/LEDs
L1-L4 = wuerth-elektronik:WE-CBF: SMD EMI Suppression Ferrite Beads - excellent anti-EMI properties - low DCR - impedances till 3000 ohms - rated current up to 6 A
L5 L6 = inductor-neosid:MS85: INDUCTOR SMD power inductor; OC_FARNELL: unknown; OC_NEWARK: unknown
MICRO_SD = DE1594-v2:MICROSD_PP
PTC = microbuilder:PTC: PTC (Resettable Fuse) 1206 Package 250mA PTC (16V Max, Time-to-Trip: 0.08s) - Digikey: F2110CT-ND 1210 Package 100mA PTC (30V Max, Time-to-Trip: 0.6s) - Digikey: MF-USMF010-2CT-ND 1812 Package 750mA PTC (24V Max, Time-to-Trip: 0.2s) - Digikey: MF-MSMF075/24-2CT-ND
R1-R5 R54-R63 R66-R89 = rcl:R-US_: RESISTOR, American symbol
R38-R41 R64 R65 = rcl:R-EU_: RESISTOR, European symbol
RESET = PushButton:PUCHBUTTON; BUTTON: RESET; RESET: RESET
TVS = diode:SUPPRESSOR-: Suppressor diode
U1 = SmartPrj:ATSAM3X/A
U2 = analog-devices:ADUM4160BRWZ: Full/Low Speed 5 kV USB Digital Isolator; MPN: ADUM4160BRWZ; OC_FARNELL: 1858056; OC_NEWARK: 24R8652; PACKAGE: SOIC-16; SUPPLIER: Analog Devices
U7 = EPROM:CK_CUSTOM_M24M02-DRMN6TP
U8-U10 = con-molex:560020-04
U$1 = NanoWifi:NANOREACH
U$3 = BLE:HM-13
X1 = con-hirose:MINI-USB-: MINI USB Connector Source: http://www.hirose.co.jp/cataloge_hp/e24000019.pdf; OC_FARNELL: unknown; OC_NEWARK: unknown
X2 = molex_clik-mate:CONN_5-1
Y1 = SmartPrj:CRYSTAL-3.2-2.5
Y2 = Arduino_Wifi_shield_v018_tG:ARDUINO_WIFI_SHIELD_V018_TG_RESONATOR_EPSON_FC_145
Z1 Z2 = varistor:VARISTOR: VARISTOR
ZEN = diode:ZENER-DIODE: Z-Diode

## Net classes
0 default: drill 0.305 mm, clearance 0.152 mm
1 USB: drill 0.406 mm, clearance 0.152 mm to class 0, clearance 0.152 mm
2 POWER_5V: width 0.61 mm, drill 0.305 mm, clearance 0.254 mm to class 0, clearance 0.254 mm to class 1, clearance 0.152 mm
3 usbvcc: width 0.61 mm, drill 0.508 mm, clearance 0.152 mm to class 0, clearance 0.254 mm to class 1, clearance 0.254 mm to class 2, clearance 0.254 mm